# EasyEDA Pro project ProPrj_FOC Motor Driver _V02.epro, schematic v_resistor_2

## Sheets
1 gate drive: Board Name: V.Phase2_v01; Create Date: 2026-07-21; Page Name: gate drive; Project Name: FOC Motor Driver; Schematic Name: v_resistor_2; Update Date: 2026-07-22; Company: EasyEDA.com; Page Size: A4; Version: V1.0
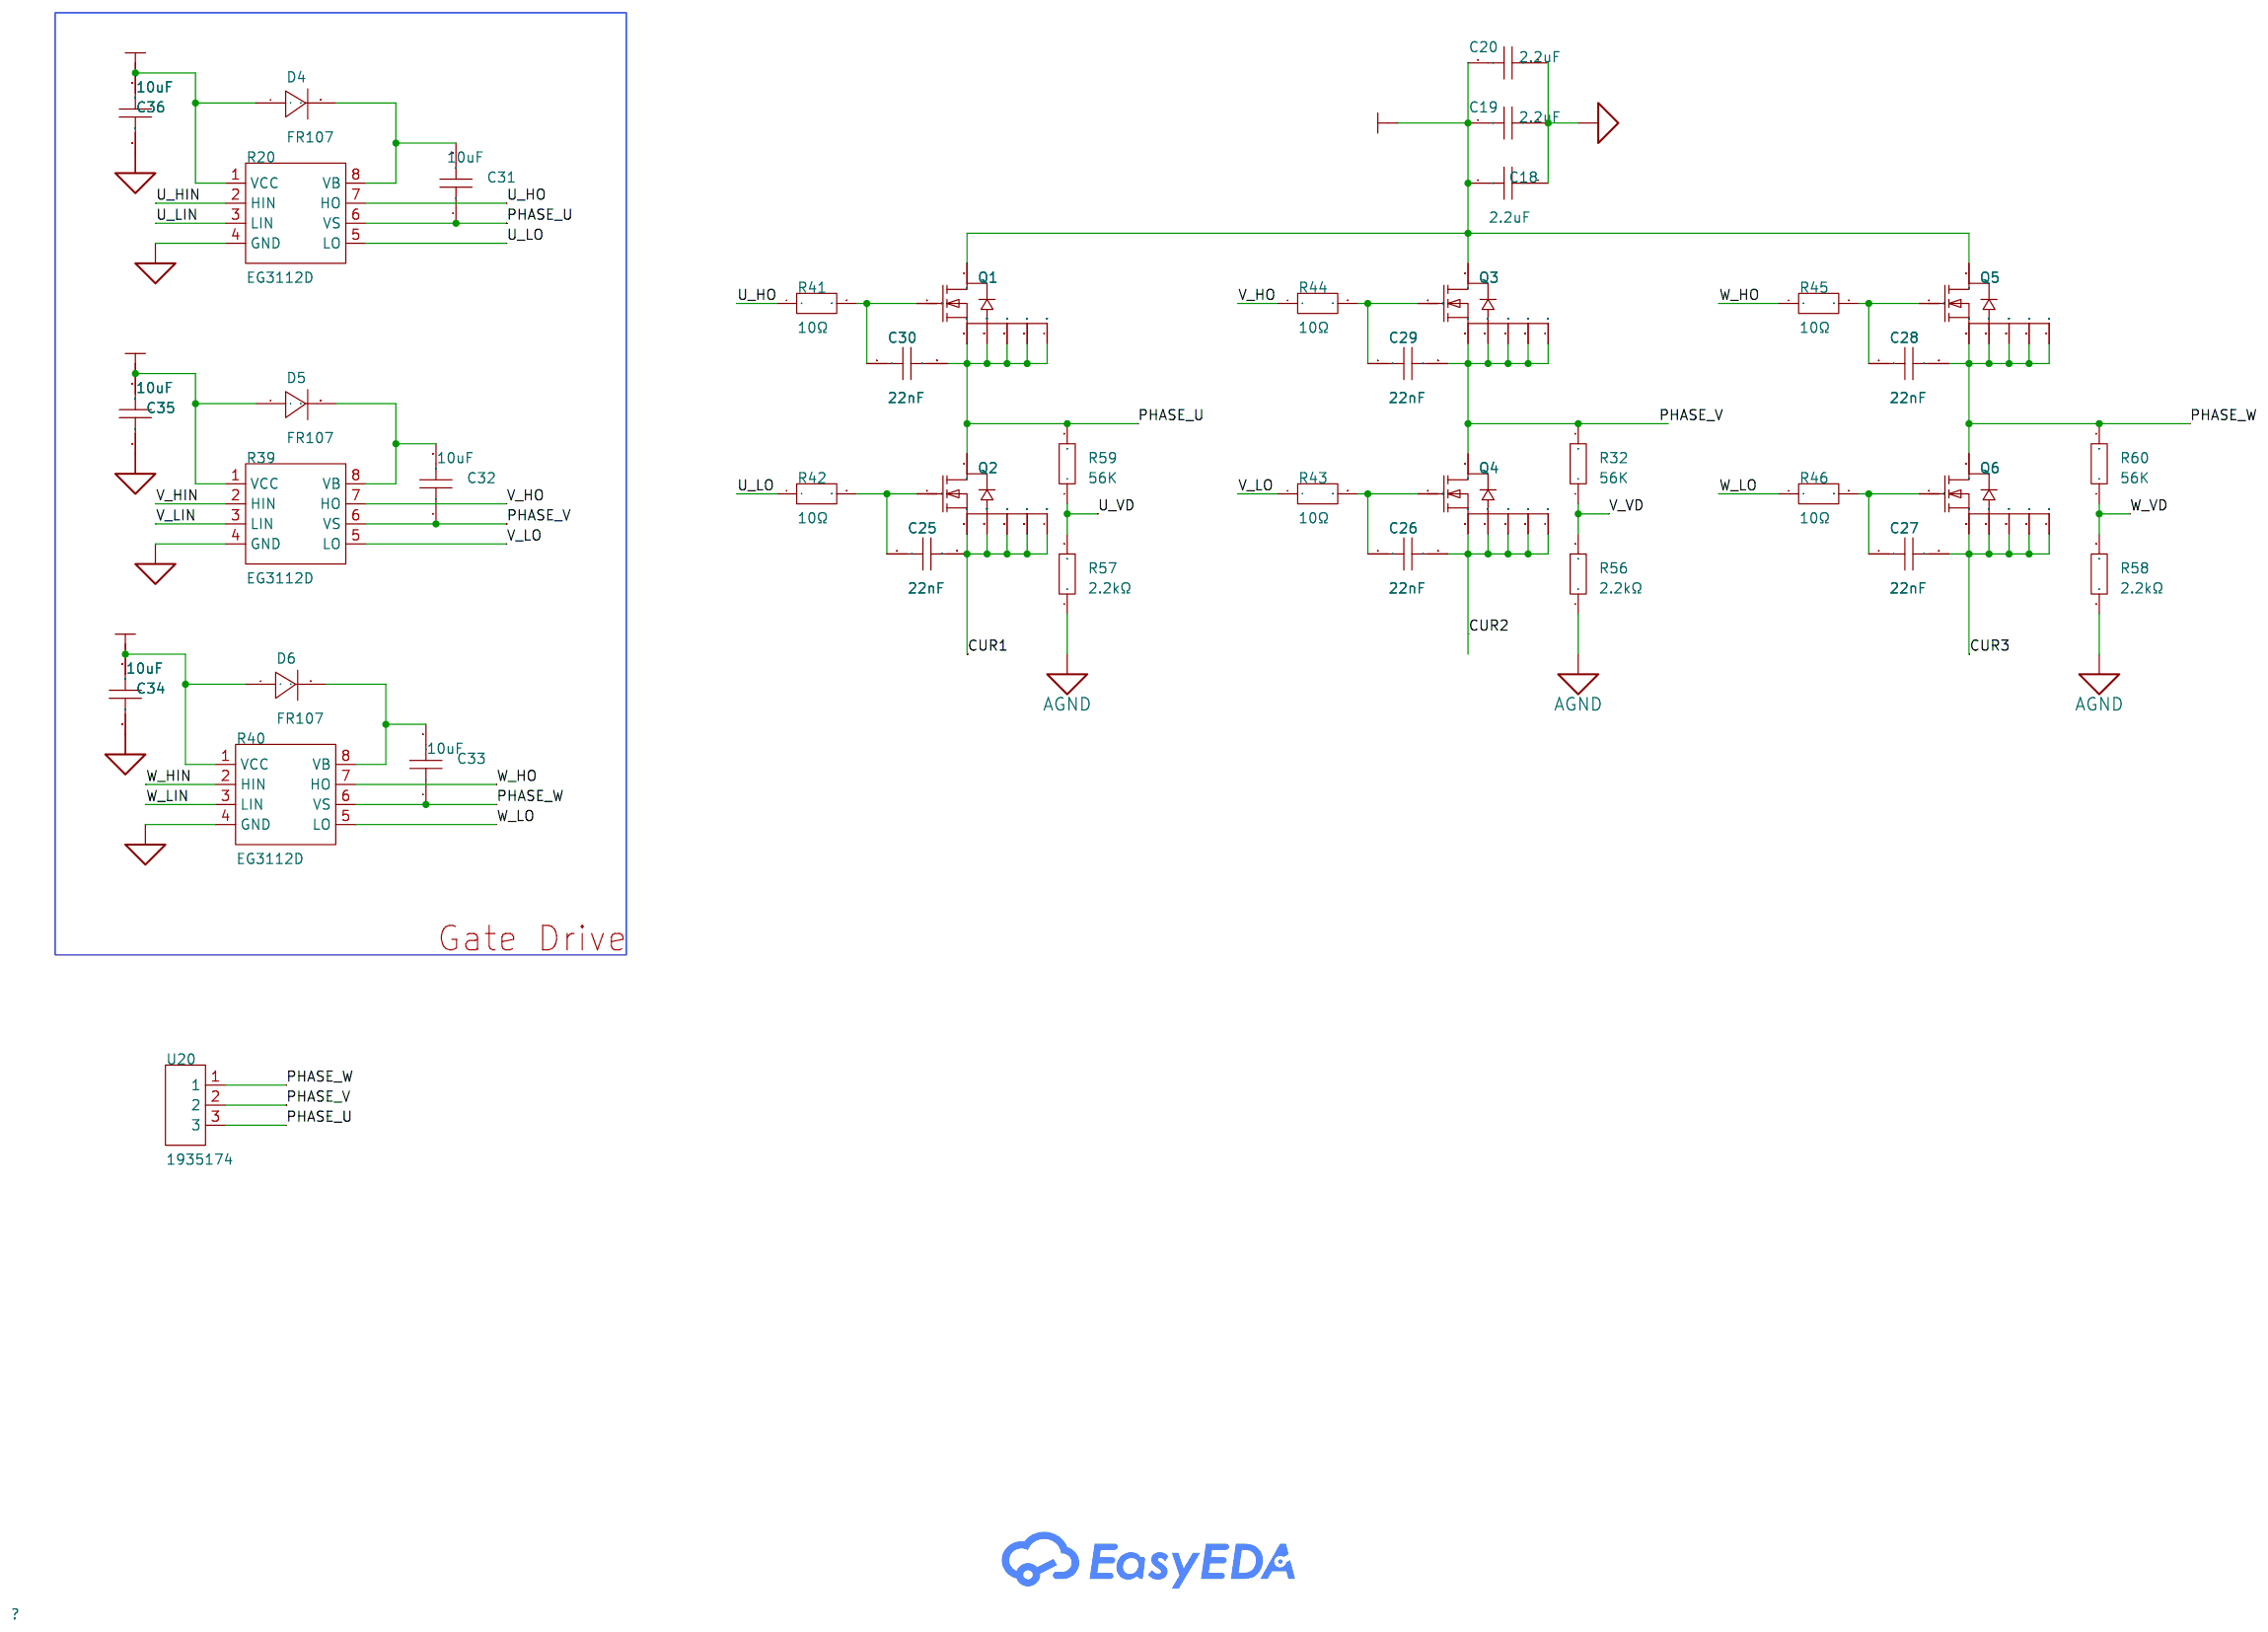
[diagram p1: gate drive]
2 MCU: Page Name: MCU; Update Date: 2026-07-30
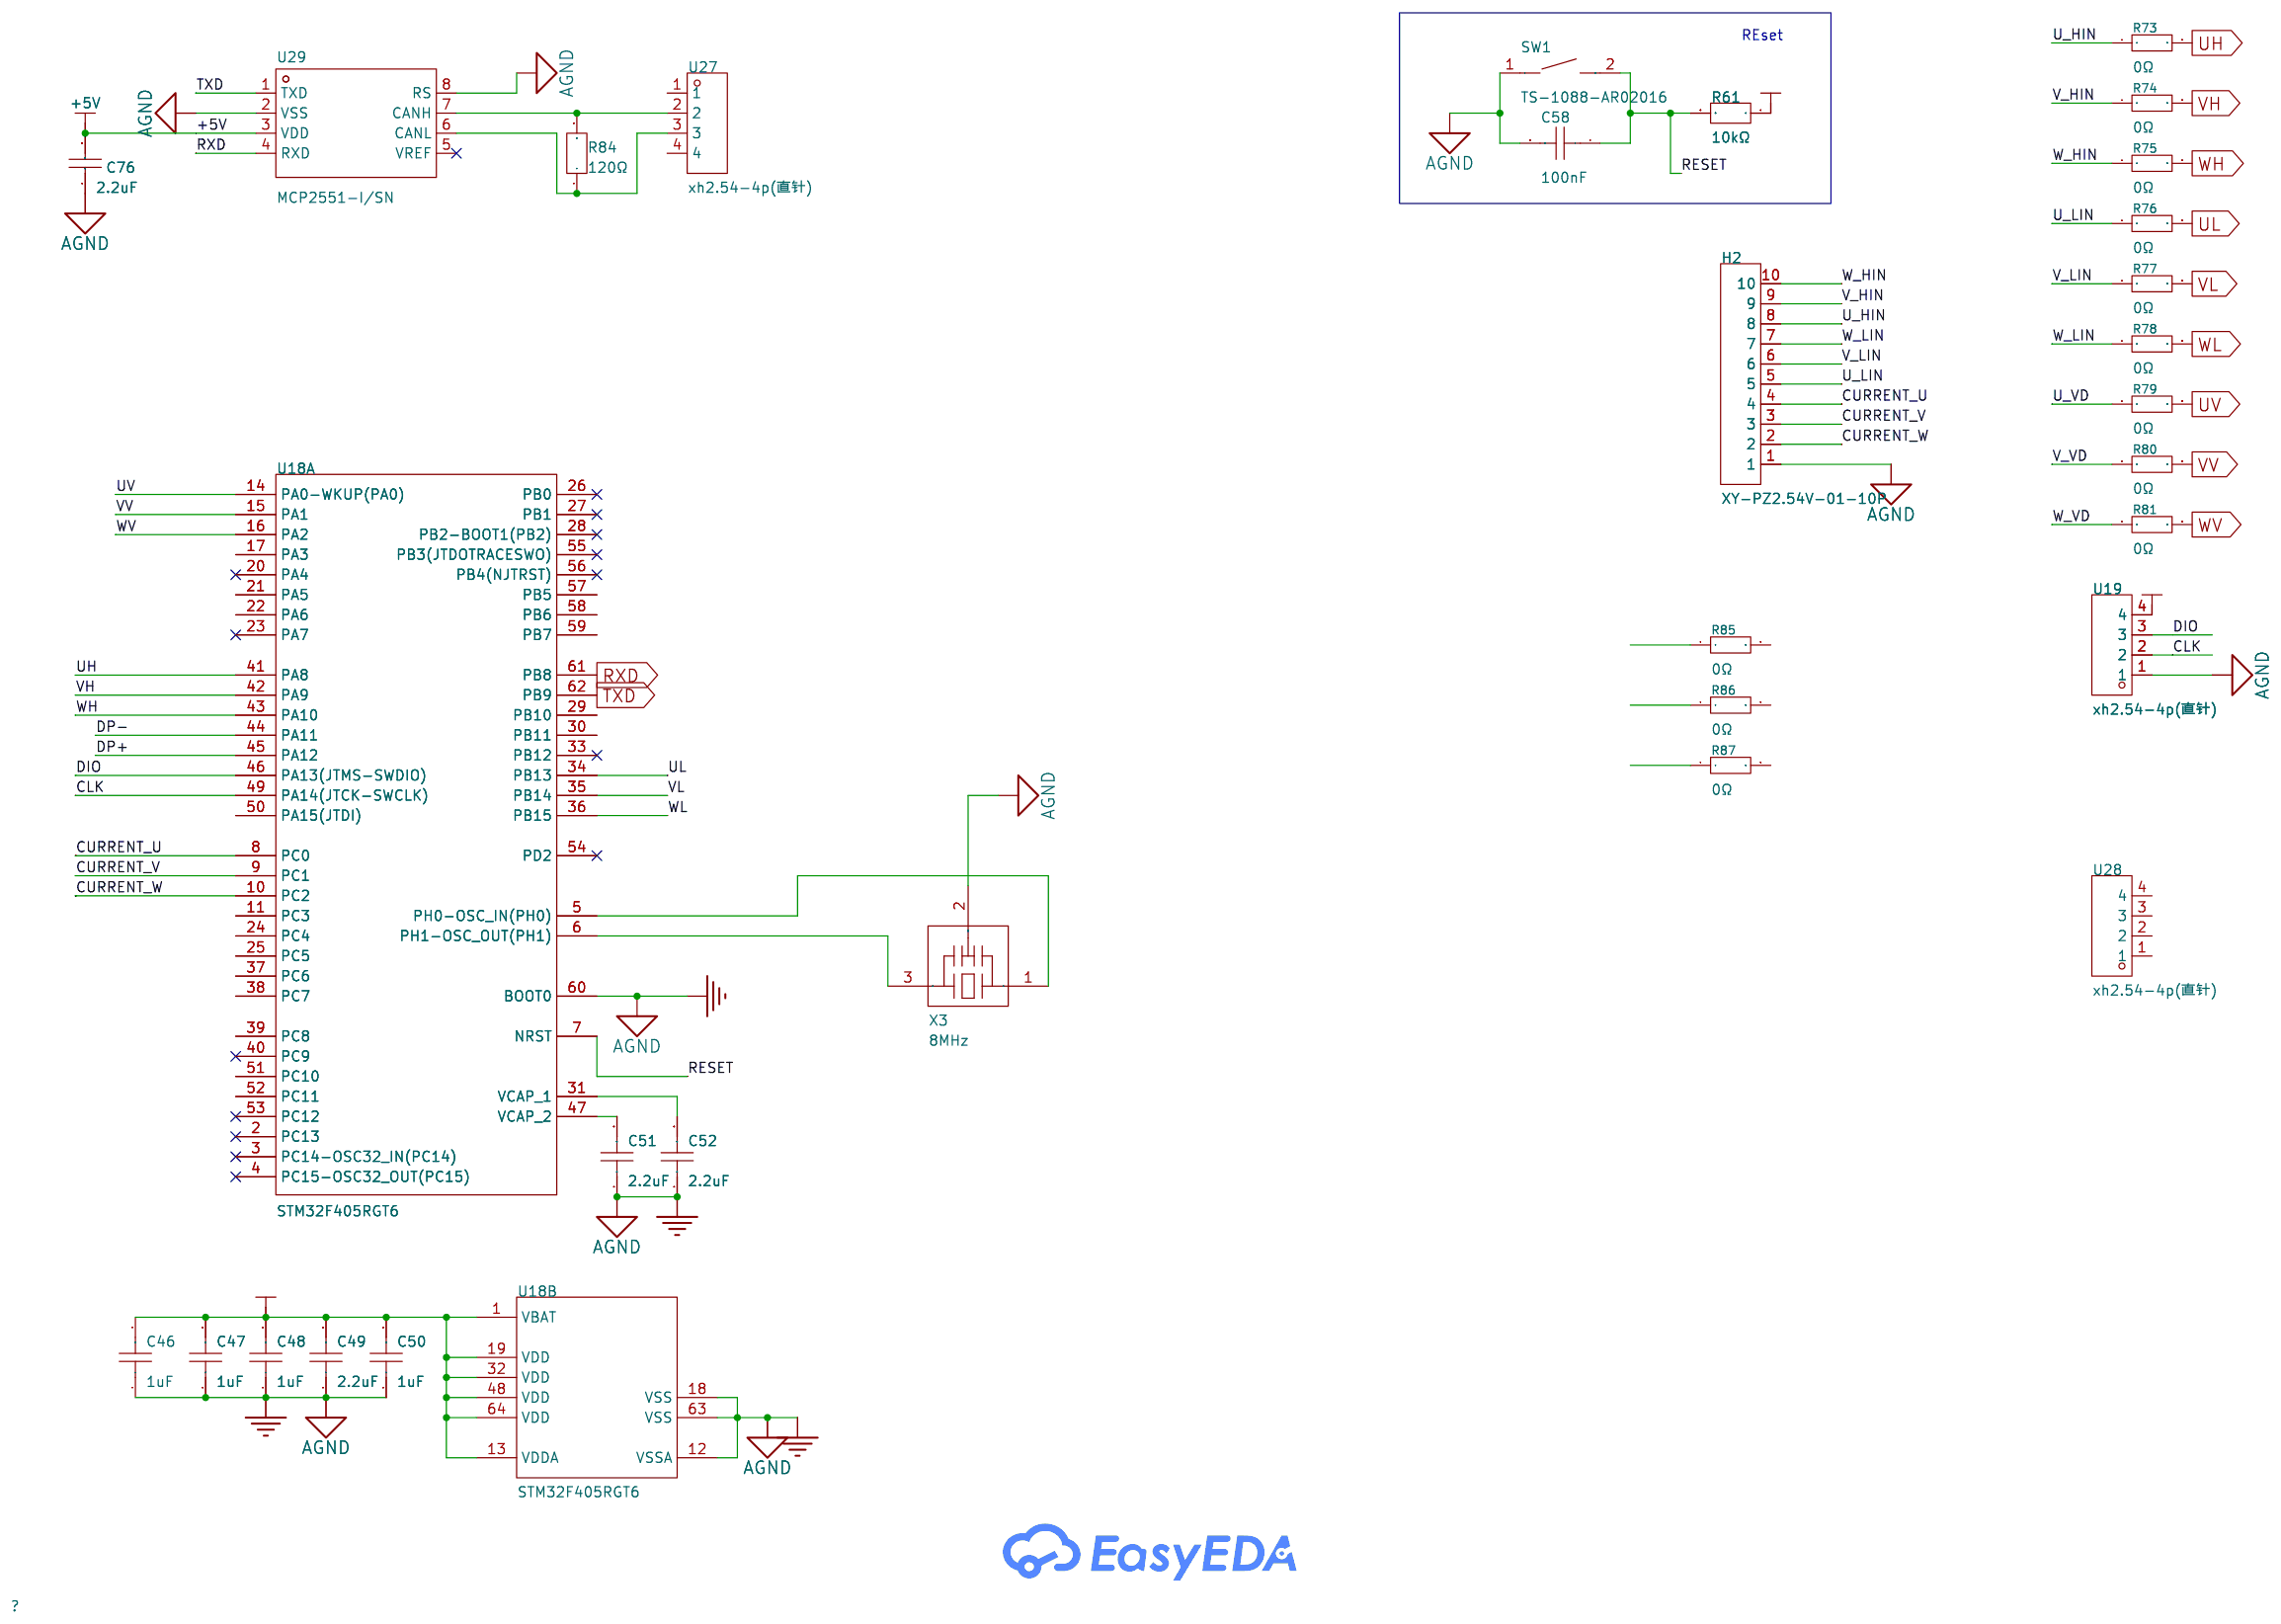
[diagram p2: MCU]
3 power Unit: Page Name: power Unit; Update Date: 2026-07-24
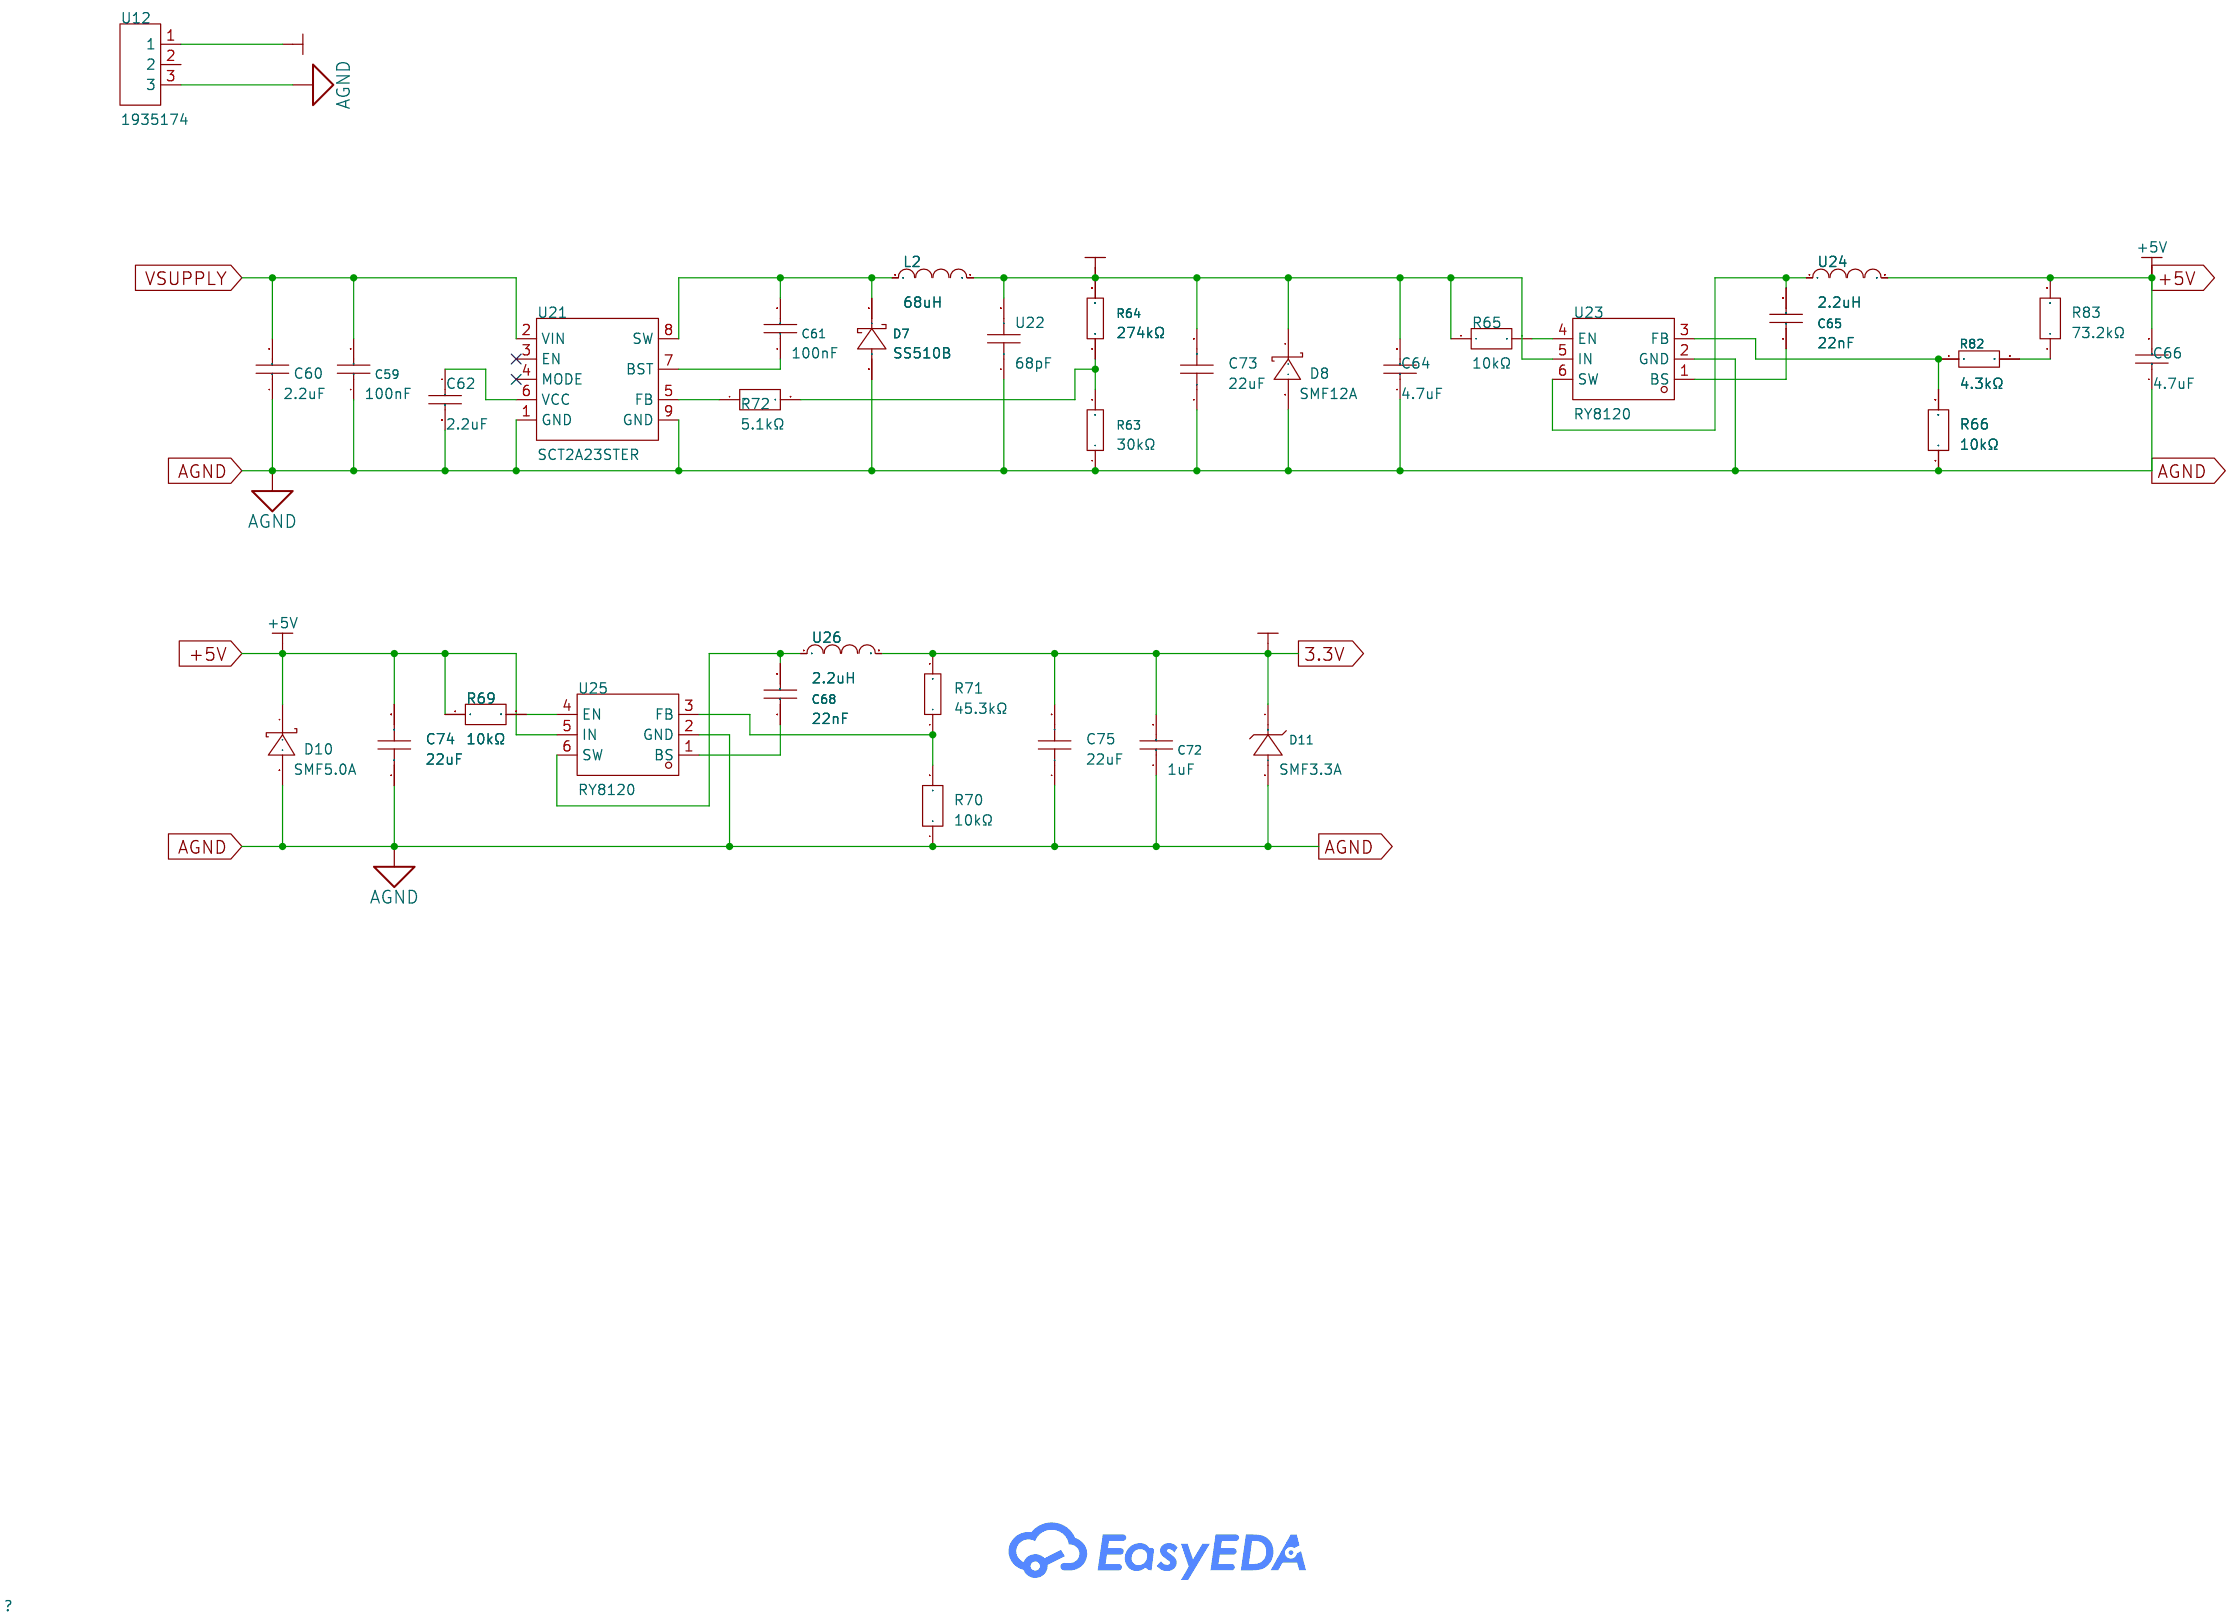
[diagram p3: power Unit]
4 CURRENT SENSE: Page Name: CURRENT SENSE; Update Date: 2026-07-21
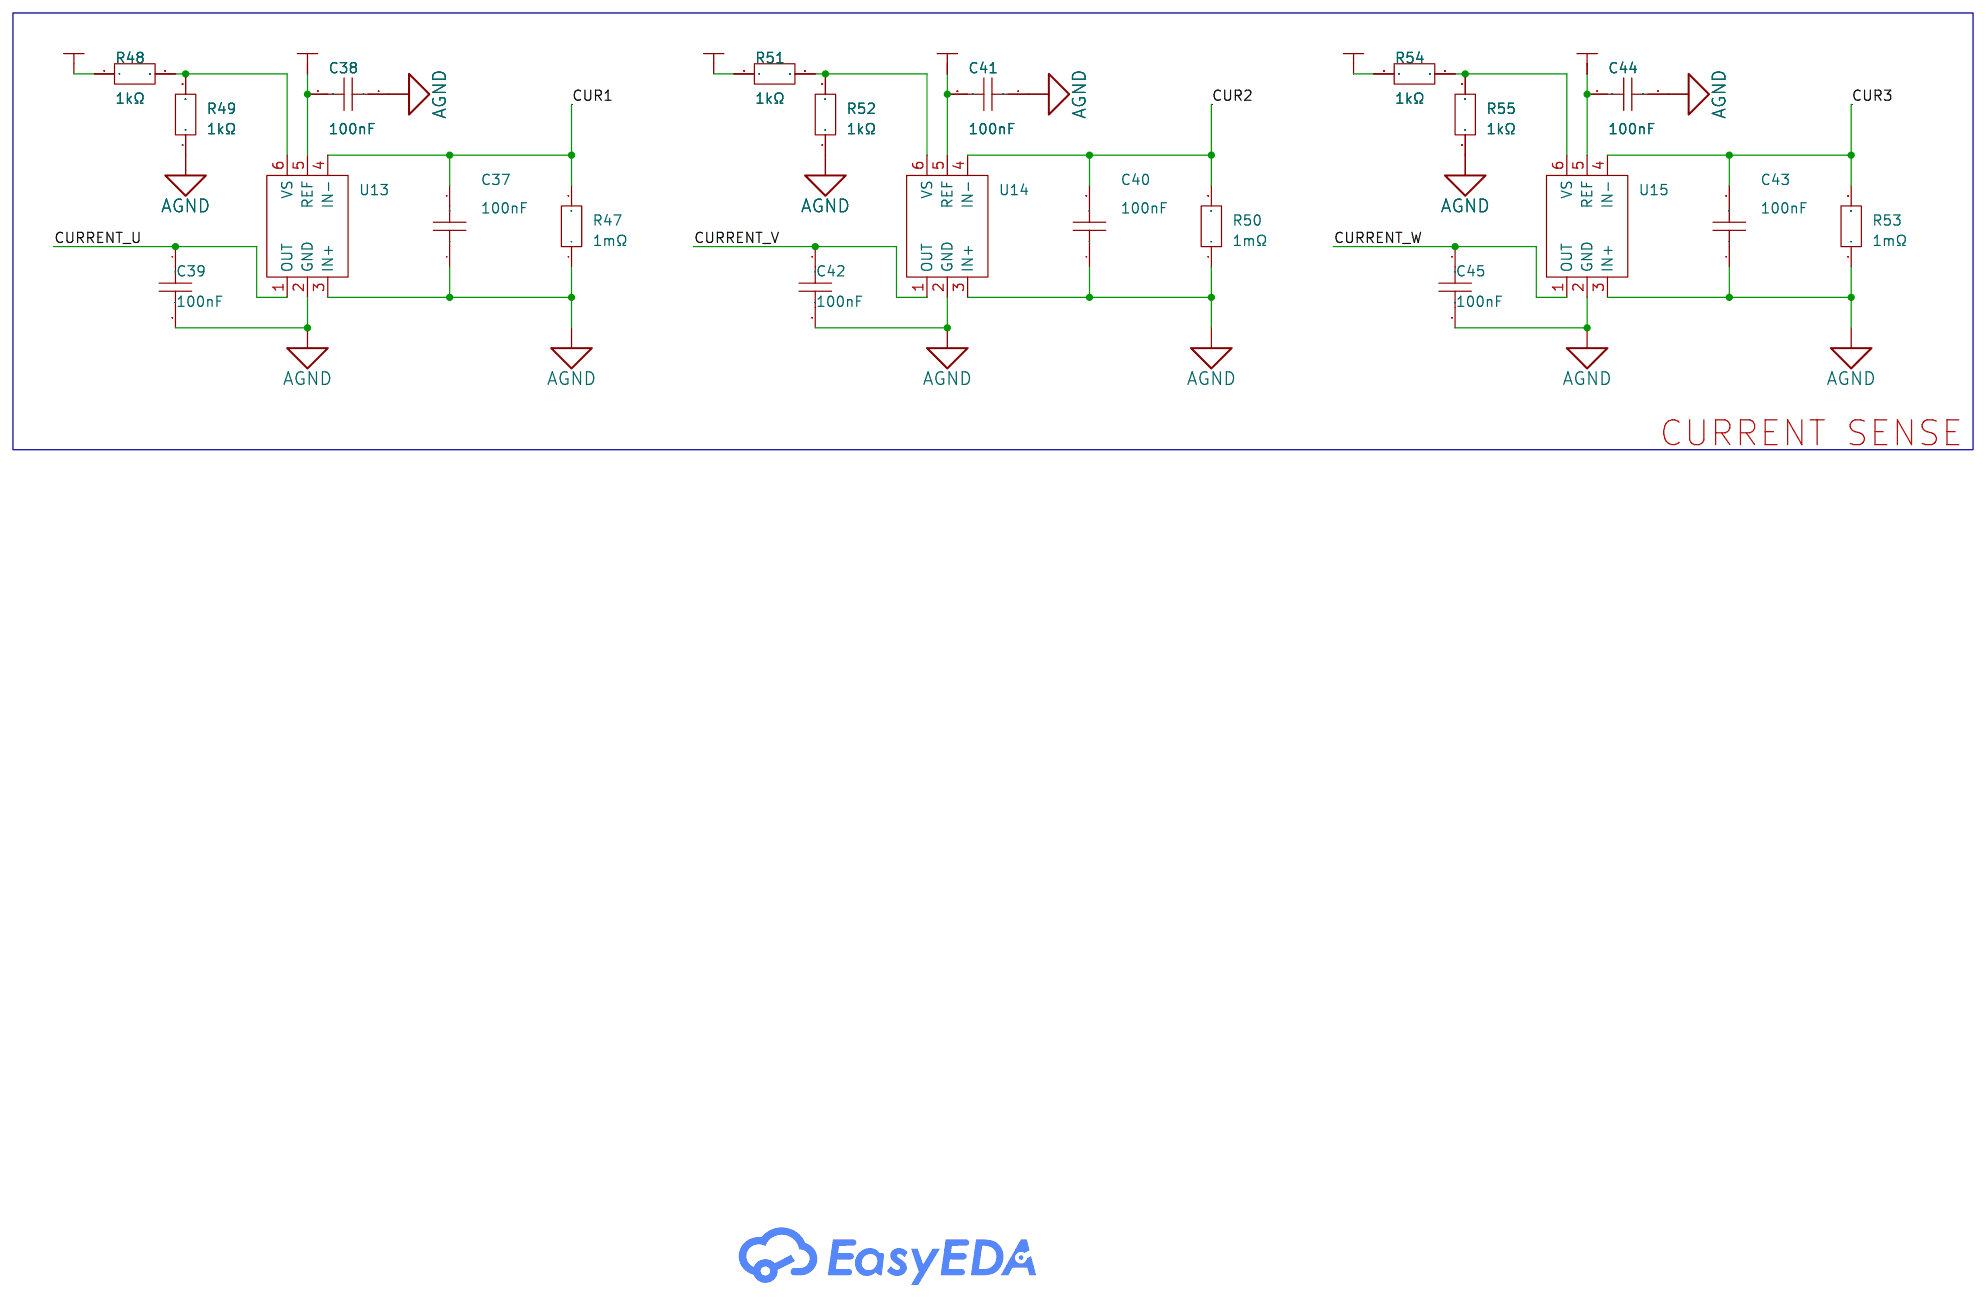
[diagram p4: CURRENT SENSE]

## Parts
sheet CURRENT SENSE
C37  100nF  [C0805]
C38  100nF  [C0805]
C39  100nF  [C0805]
C40  100nF  [C0805]
C41  100nF  [C0805]
C42  100nF  [C0805]
C43  100nF  [C0805]
C44  100nF  [C0805]
C45  100nF  [C0805]
R47  1mΩ  [R2512]
R48  1kΩ  [R0805]
R49  1kΩ  [R0805]
R50  1mΩ  [R2512]
R51  1kΩ  [R0805]
R52  1kΩ  [R0805]
R53  1mΩ  [R2512]
R54  1kΩ  [R0805]
R55  1kΩ  [R0805]
U13  INA181A1IDBVR  [SOT-23-6_L2.9-W1.6-P0.95-LS2.8-TL]
U14  INA181A1IDBVR  [SOT-23-6_L2.9-W1.6-P0.95-LS2.8-TL]
U15  INA181A1IDBVR  [SOT-23-6_L2.9-W1.6-P0.95-LS2.8-TL]
sheet gate drive
C18  2.2uF  [C0805]
C19  2.2uF  [C0805]
C20  2.2uF  [C0805]
C25  22nF  [C1206]
C26  22nF  [C1206]
C27  22nF  [C1206]
C28  22nF  [C1206]
C29  22nF  [C1206]
C30  22nF  [C1206]
C31  10uF  [C0805]
C32  10uF  [C0805]
C33  10uF  [C0805]
C34  10uF  [C0805]
C35  10uF  [C0805]
C36  10uF  [C0805]
D4  FR107  [SMA_L4.2-W2.7-LS5.3-FD]
D5  FR107  [SMA_L4.2-W2.7-LS5.3-FD]
D6  FR107  [SMA_L4.2-W2.7-LS5.3-FD]
Q1  IRFS7530TRL7PP  [D2PAK-7_L10.6-W9.6-P1.27-LS15.9-BR]
Q2  IRFS7530TRL7PP  [D2PAK-7_L10.6-W9.6-P1.27-LS15.9-BR]
Q3  IRFS7530TRL7PP  [D2PAK-7_L10.6-W9.6-P1.27-LS15.9-BR]
Q4  IRFS7530TRL7PP  [D2PAK-7_L10.6-W9.6-P1.27-LS15.9-BR]
Q5  IRFS7530TRL7PP  [D2PAK-7_L10.6-W9.6-P1.27-LS15.9-BR]
Q6  IRFS7530TRL7PP  [D2PAK-7_L10.6-W9.6-P1.27-LS15.9-BR]
R20  EG3112D  [SOP-8_L5.0-W3.9-P1.27-LS6.0-BL-1]
R32  56K  [R0805_NEW]
R39  EG3112D  [SOP-8_L5.0-W3.9-P1.27-LS6.0-BL-1]
R40  EG3112D  [SOP-8_L5.0-W3.9-P1.27-LS6.0-BL-1]
R41  10Ω  [R0603]
R42  10Ω  [R0603]
R43  10Ω  [R0603]
R44  10Ω  [R0603]
R45  10Ω  [R0603]
R46  10Ω  [R0603]
R56  2.2kΩ  [R0805]
R57  2.2kΩ  [R0805]
R58  2.2kΩ  [R0805]
R59  56K  [R0805_NEW]
R60  56K  [R0805_NEW]
U20  1935174  [CONN-TH_3P-P5.00_1935174]
sheet MCU
C46  1uF  [C0805]
C47  1uF  [C0805]
C48  1uF  [C0805]
C49  2.2uF  [C0805]
C50  1uF  [C0805]
C51  2.2uF  [C0805]
C52  2.2uF  [C0805]
C58  100nF  [C0805]
C76  2.2uF  [C1206]
H2  XY-PZ2.54V-01-10P  [HDR-TH_10P-P2.54-V-M_4]
R61  10kΩ  [R0805]
R73  0Ω  [R1206]
R74  0Ω  [R1206]
R75  0Ω  [R1206]
R76  0Ω  [R1206]
R77  0Ω  [R1206]
R78  0Ω  [R1206]
R79  0Ω  [R1206]
R80  0Ω  [R1206]
R81  0Ω  [R1206]
R84  120Ω  [R0805]
R85  0Ω  [R1206]
R86  0Ω  [R1206]
R87  0Ω  [R1206]
SW1  TS-1088-AR02016  [SW-SMD_L3.9-W3.0-P4.45]
U18  STM32F405RGT6  [LQFP-64_L10.0-W10.0-P0.50-LS12.0-BL]  (sections 1,2)
U19  xh2.54-4p(直针)  [CONN-TH_4P-P2.50-XH2.54-4P]
U27  xh2.54-4p(直针)  [CONN-TH_4P-P2.50-XH2.54-4P]
U28  xh2.54-4p(直针)  [CONN-TH_4P-P2.50-XH2.54-4P]
U29  MCP2551-I/SN  [SOIC-8_L4.9-W3.9-P1.27-LS6.0-BL]
X3  8MHz  [OSC-SMD_3P-L3.2-W1.3-P1.2-L]
sheet power Unit
C59  100nF  [C1206]
C60  2.2uF  [C1206]
C61  100nF  [C1206]
C62  2.2uF  [C1206]
C64  4.7uF  [C0805]
C65  22nF  [C0805]
C66  4.7uF  [C0805]
C68  22nF  [C0805]
C72  1uF  [C0805]
C73  22uF  [C0805]
C74  22uF  [C0805]
C75  22uF  [C0805]
D7  SS510B  [SMB_L4.3-W3.6-LS5.3-RD]
D8  SMF12A  [SOD-123_L2.8-W1.8-LS3.7-RD]
D10  SMF5.0A  [SOD-123_L2.8-W1.8-LS3.7-RD]
D11  SMF3.3A  [SOD-123_L2.8-W1.8-LS3.7-RD]
L2  68uH  [IND-SMD_L7.8-W7.0_SCD0705N]
R63  30kΩ  [R0603]
R64  274kΩ  [R0805]
R65  10kΩ  [R0603]
R66  10kΩ  [R0603]
R69  10kΩ  [R0603]
R70  10kΩ  [R0603]
R71  45.3kΩ  [R0603]
R72  5.1kΩ  [R1206]
R82  4.3kΩ  [R0603]
R83  73.2kΩ  [R0603]
U12  1935174  [CONN-TH_3P-P5.00_1935174]
U21  SCT2A23STER  [ESOP-8_L4.9-W3.9-P1.27-LS6.0-BL-EP-1]
U22  68pF  [C0805]
U23  RY8120  [SOT-23-6_L2.9-W1.6-P0.95-LS2.8-BL]
U24  2.2uH  [IND-SMD_L2.5-W2.0-VLS252012CX-150M]
U25  RY8120  [SOT-23-6_L2.9-W1.6-P0.95-LS2.8-BL]
U26  2.2uH  [IND-SMD_L2.5-W2.0-VLS252012CX-150M]

## Library data of the parts
C37-C45 C58 = C0805X104K5RAC3123: Capacitance:100nF Tolerance:±10% Tolerance:±10% Voltage Rating:50V Temperature Coefficient:X7R; LCSC Part Name: 100nF ±10% 50V; Supplier Part: C141171; Manufacturer: KEMET(基美); Supplier Footprint: 0805; JLCPCB Part Class: Extended Part; Datasheet: https://item.szlcsc.com/datasheet/C0805X104K5RAC3123/152501.html; Supplier: LCSC; Tolerance: ±10%; Voltage Rating: 50V; Temperature Coefficient: X7R
R47 R50 R53 = HIXD25LR001F: Type:Alloy Resistor Resistance:1mΩ Tolerance:±1% Tolerance:±1% Power(Watts):2W Temperature Coefficient:±350ppm/℃ Temperature Coefficient:±350ppm/℃ Mounting Type:SMD; LCSC Part Name: 1mΩ ±1% 2W; Supplier Part: C52015882; Manufacturer: RVR(鹏科); Supplier Footprint: 2512; JLCPCB Part Class: Extended Part; Datasheet: https://item.szlcsc.com/datasheet/HIXD25LR001F/54758989.html; Supplier: LCSC; Type: Alloy Resistor; Tolerance: ±1%; Power(Watts): 2W; Temperature Coefficient: ±350ppm/℃; Mounting Type: SMD
R48 R49 R51 R52 R54 R55 R61 = AS05W3J0102T5E: Type:Thick Film Resistors Resistance:1kΩ Tolerance:±5% Tolerance:±5% Power(Watts): Overload Voltage (Max): Operating Temperature Range:-55℃~+155℃ Operating Temperature Range:-55℃~+155℃; LCSC Part Name: 1kΩ ±5% 333.333mW 厚膜电阻; Supplier Part: C966151; Manufacturer: UNI-ROYAL(厚声); Supplier Footprint: 0805; JLCPCB Part Class: Extended Part; Datasheet: https://atta.szlcsc.com/upload/public/pdf/source/20200723/C560412_34ABBCC623B52ADD707B94178459E29E.pdf; Supplier: LCSC; Type: Thick Film Resistors; Tolerance: ±5%; Operating Temperature Range: -55℃~+155℃
U13-U15 = INA181A1IDBVR: Number of Channels:1 Vcm - Common Mode Voltage:-200mV~26V Vcm - Common Mode Voltage:-200mV~26V Gain:20V/V Bandwidth:350kHz Ib - Input Bias Current:6uA Vos - Input Offset Voltage:25uV Operating Temperature:-40℃~+125℃ Operating Temperature:-40℃~+125℃ Differ; LCSC Part Name: 双向低侧和高侧电压输出电流感应放大器; Supplier Part: C2058943; Manufacturer: TI(德州仪器); Supplier Footprint: SOT-23-6; JLCPCB Part Class: Extended Part; Datasheet: https://www.ti.com/cn/lit/ds/symlink/ina4181.pdf; Supplier: LCSC; Number of Channels: 1; Vcm - Common Mode Voltage: -200mV~26V; Gain: 20V/V; Bandwidth: 350kHz; Ib - Input Bias Current: 6uA; Vos - Input Offset Voltage: 25uV; Operating Temperature: -40℃~+125℃; Differential Voltage: ±26V; Single Supply: 2.7V~5.5V; Quiescent Current: 195uA; Output Current: 8mA; Input Offset Voltage Drift(Vos TC): 1uV/℃; Input Offset Current(Ios): 0.05uA; Slew Rate: 2V/us; Common Mode Rejection Ratio (CMRR): 100dB; Noise density(eN): 40nV/√Hz@1kHz; Features: Analog output interface；Bidirectional detection；High-side detection；Low-side detection；Programmable output reference level
C18-C20 = CL21A225KBQNNNE: Capacitance:2.2uF Tolerance:±10% Tolerance:±10% Voltage Rating:50V Temperature Coefficient:X5R; LCSC Part Name: 2.2uF ±10% 50V; Supplier Part: C377773; Manufacturer: SAMSUNG(三星); Supplier Footprint: 0805; Datasheet: https://item.szlcsc.com/datasheet/CL21A225KBQNNNE/350246.html; Supplier: LCSC; Tolerance: ±10%; Voltage Rating: 50V; Temperature Coefficient: X5R
C25-C30 = HHV1206R7223K631NSPJ: Capacitance:22nF Tolerance:±10% Tolerance:±10% Voltage Rating:630V Temperature Coefficient:X7R; LCSC Part Name: 22nF ±10% 630V; Supplier Part: C5186842; Manufacturer: Chinocera(华瓷); Supplier Footprint: 1206; JLCPCB Part Class: Extended Part; Datasheet: https://item.szlcsc.com/datasheet/HHV1206R7223K631NSPJ/5857851.html; Supplier: LCSC; Tolerance: ±10%; Voltage Rating: 630V; Temperature Coefficient: X7R
C31-C36 = GRM21BR61H106KE43L: Capacitance:10uF Tolerance:±10% Tolerance:±10% Voltage Rating:50V Temperature Coefficient:X5R; LCSC Part Name: 10uF ±10% 50V; Supplier Part: C440198; Manufacturer: muRata(村田); Supplier Footprint: 0805; JLCPCB Part Class: Basic Part; Datasheet: https://item.szlcsc.com/datasheet/GRM21BR61H106KE43L/439567.html; Supplier: LCSC; Tolerance: ±10%; Voltage Rating: 50V; Temperature Coefficient: X5R
D4-D6 = FR107: Diode Configuration:Independent Type Forward Voltage (Vf@If):1.3V@1A Reverse Voltage (Vr): Rectified Current:1A Reverse Leakage Current:5mA@1kV Reverse Recovery Time (trr): Operating Temperature:-65℃~+150℃@(Tj) Operating Temperature:-65℃~+150℃@(Tj); LCSC Part Name: 电压:1kV 电流:1A 打扁工艺; Supplier Part: C2934869; Manufacturer: YONGYUTAI(永裕泰); Supplier Footprint: SMA; Datasheet: https://atta.szlcsc.com/upload/public/pdf/source/20211220/09EF9D5C307779228ED577DD161FCE60.pdf; Supplier: LCSC; Diode Configuration: Independent Type; Forward Voltage (Vf@If): 1.3V@1A; Rectified Current: 1A; Reverse Leakage Current: 5mA@1kV; Operating Temperature: -65℃~+150℃@(Tj)
Q1-Q6 = IRFS7530TRL7PP: Number:1 N-Channel Drain to Source Voltage:60V Current - Continuous Drain(Id):338A RDS(on):1.4mΩ@10V,100A Pd - Power Dissipation:375W Gate Threshold Voltage (Vgs(th)):3.7V Gate Charge(Qg):354nC@10V Input Capacitance(Ciss):12.96nF Reverse Transfer Capacita; LCSC Part Name: 1个N沟道 耐压:60V 电流:338A; Supplier Part: C445669; Manufacturer: Infineon(英飞凌); Supplier Footprint: TO-263-7; JLCPCB Part Class: Extended Part; Datasheet: https://item.szlcsc.com/datasheet/IRFS7530TRL7PP/447258.html; Supplier: LCSC; Number: 1 N-Channel; Drain to Source Voltage: 60V; Current - Continuous Drain(Id): 338A; RDS(on): 1.4mΩ@10V,100A; Pd - Power Dissipation: 375W; Gate Threshold Voltage (Vgs(th)): 3.7V; Gate Charge(Qg): 354nC@10V; Input Capacitance(Ciss): 12.96nF; Reverse Transfer Capacitance (Crss@Vds): 760pF; Operating Temperature: -55℃~+175℃
R20 R39 R40 = EG3112D: Driven Configuration:Low Side；High Side Load Type:MOSFET；IGBT Number of Drivers:2 Current - Output Low(IOL):2.5A Current - Output High(IOH):2A Voltage - Supply:4V~20V Voltage - Supply:4V~20V Rise Time:120ns Fall Time:80ns Propagation Delay tpLH:- Propagat; LCSC Part Name: 大功率MOS管、IGBT管栅极驱动芯片; Supplier Part: C2929096; Manufacturer: EG(屹晶微); Supplier Footprint: SOP-8; JLCPCB Part Class: Extended Part; Datasheet: https://item.szlcsc.com/datasheet/EG3112D/3261573.html; Supplier: LCSC; Driven Configuration: Low Side；High Side; Load Type: MOSFET；IGBT; Number of Drivers: 2; Current - Output Low(IOL): 2.5A; Current - Output High(IOH): 2A; Voltage - Supply: 4V~20V; Rise Time: 120ns; Fall Time: 80ns; Operating Temperature: -45℃~+125℃; Input Logic Level - Low: -300mV~1V; Quiescent Current(Iq): 50uA
R32 R59 R60 = RK73H1JTTD10R0F: Type:Thick Film Resistors Resistance: Tolerance:±1% Tolerance:±1% Power(Watts): Overload Voltage (Max): Temperature Coefficient:±100ppm/℃ Temperature Coefficient:±100ppm/℃ Operating Temperature Range:-55℃~+155℃ Operating Temperature Range:-55℃~+155℃; LCSC Part Name: 厚膜电阻 10Ω ±1% 125mW; Supplier Part: C173372; Manufacturer: KOA; Supplier Footprint: 0603; JLCPCB Part Class: Extended Part; Datasheet: https://atta.szlcsc.com/upload/public/pdf/source/20180910/C284139_D19228803A916EF20734AAE00A9B1EE6.pdf; Supplier: LCSC; Type: Thick Film Resistors; Tolerance: ±1%; Temperature Coefficient: ±100ppm/℃; Operating Temperature Range: -55℃~+155℃
R41-R46 = WF06P10R0FTL: Resistance:10Ω Tolerance:±1% Tolerance:±1% Power(Watts):125mW Voltage-Supply(Max):50V Temperature Coefficient:±100ppm/℃ Temperature Coefficient:±100ppm/℃ Operating Temperature:-55℃~+155℃ Operating Temperature:-55℃~+155℃; LCSC Part Name: 10Ω ±1% 125mW; Supplier Part: C2885454; Manufacturer: Walsin(华新科); Supplier Footprint: 0603; JLCPCB Part Class: Extended Part; Datasheet: https://item.szlcsc.com/datasheet/WF06P10R0FTL/3096111.html; Supplier: LCSC; Tolerance: ±1%; Power(Watts): 125mW; Voltage-Supply(Max): 50V; Temperature Coefficient: ±100ppm/℃; Operating Temperature: -55℃~+155℃
R56-R58 = RK73B2ATTD222J: Type:Thick Film Resistors Resistance: Tolerance:±5% Tolerance:±5% Power(Watts): Overload Voltage (Max): Temperature Coefficient:±200ppm/℃ Temperature Coefficient:±200ppm/℃ Operating Temperature Range:-55℃~+155℃ Operating Temperature Range:-55℃~+155℃; LCSC Part Name: 厚膜电阻 2.2kΩ ±5% 250mW; Supplier Part: C159914; Manufacturer: KOA; Supplier Footprint: 0805; Datasheet: https://atta.szlcsc.com/upload/public/pdf/source/20190412/C306845_C691C67B9FF4609DA2A4DC602C4F98FE.pdf; Supplier: LCSC; Type: Thick Film Resistors; Tolerance: ±5%; Temperature Coefficient: ±200ppm/℃; Operating Temperature Range: -55℃~+155℃
U12 U20 = 1935174: Number of Positions or Pins:1x3P Pitch:5mm Color:Green Mounting Type:Through Hole Number of Pins:3P Number of Rows:1 Number of PINs Per Row:3 Current Rating:18A Voltage Rating (Max):300V Wire Gauge - AWG:12~26 Operating Temperature:- Operating Temperature; LCSC Part Name: 1x3P 5mm 直插 排数:1 每排P数:3; Supplier Part: C3816891; Manufacturer: Phoenix Contact(菲尼克斯); Supplier Footprint: 插件,P=5mm; JLCPCB Part Class: Extended Part; Datasheet: https://item.szlcsc.com/datasheet/1935174/4384565.html; Supplier: LCSC; Number of Positions or Pins: 1x3P; Pitch: 5mm; Color: Green; Mounting Type: Through Hole; Number of Pins: 3P; Number of Rows: 1; Number of PINs Per Row: 3; Current Rating: 18A; Voltage Rating (Max): 300V; Wire Gauge - AWG: 12~26
C46-C52 = FS21X105K160ECG: Capacitance:1uF Tolerance:±10% Tolerance:±10% Voltage Rating:16V Temperature Coefficient:X7R; LCSC Part Name: 1uF ±10% 16V; Supplier Part: C525343; Manufacturer: PSA(信昌电陶); Supplier Footprint: 0805; JLCPCB Part Class: Extended Part; Datasheet: https://item.szlcsc.com/datasheet/FS21X105K160ECG/543470.html; Supplier: LCSC; Tolerance: ±10%; Voltage Rating: 16V; Temperature Coefficient: X7R
C60 C62 C76 = CL31B225KBHNNNE: Capacitance:2.2uF Tolerance:±10% Tolerance:±10% Voltage Rating:50V Temperature Coefficient:X7R; LCSC Part Name: 2.2uF ±10% 50V; Supplier Part: C50254; Manufacturer: SAMSUNG(三星); Supplier Footprint: 1206; Datasheet: https://item.szlcsc.com/datasheet/CL31B225KBHNNNE/51263.html; Supplier: LCSC; Tolerance: ±10%; Voltage Rating: 50V; Temperature Coefficient: X7R
H2 = XY-PZ2.54V-01-10P: LCSC Part Name: 1x10P 间距:2.54mm 方针 直插; Supplier Part: C53244518; Manufacturer: XYECONN(辛译); Supplier Footprint: 插件,P=2.54mm; JLCPCB Part Class: Extended Part; Datasheet: https://item.szlcsc.com/datasheet/XY-PZ2.54V-01-10P/56301404.html; Supplier: LCSC
R73-R81 R85-R87 = 1206W4F0000T5E: Type:Thick Film Resistor Resistance:0Ω Tolerance:±1% Tolerance:±1% Power(Watts):250mW Voltage-Supply(Max):200V Temperature Coefficient:±800ppm/℃ Temperature Coefficient:±800ppm/℃ Operating Temperature:-55℃~+155℃ Operating Temperature:-55℃~+155℃; LCSC Part Name: 0Ω ±1% 250mW 厚膜电阻; Supplier Part: C17888; Manufacturer: UNI-ROYAL(厚声); Supplier Footprint: 1206; Datasheet: https://item.szlcsc.com/datasheet/1206W4F0000T5E/18576.html; Supplier: LCSC; Type: Thick Film Resistor; Tolerance: ±1%; Power(Watts): 250mW; Voltage-Supply(Max): 200V; Temperature Coefficient: ±800ppm/℃; Operating Temperature: -55℃~+155℃
R84 = CRGCQ0805F120R: Type:Thick Film Resistor Resistance:120Ω Tolerance:±1% Tolerance:±1% Power(Watts):125mW Temperature Coefficient:±100ppm/℃ Temperature Coefficient:±100ppm/℃ Operating Temperature:-55℃~+155℃ Operating Temperature:-55℃~+155℃; LCSC Part Name: 厚膜电阻 120Ω ±1% 125mW; Supplier Part: C5162608; Manufacturer: TE Connectivity(泰科电子); Supplier Footprint: 0805; JLCPCB Part Class: Extended Part; Datasheet: https://item.szlcsc.com/datasheet/CRGCQ0805F120R/5811582.html; Supplier: LCSC; Type: Thick Film Resistor; Tolerance: ±1%; Power(Watts): 125mW; Temperature Coefficient: ±100ppm/℃; Operating Temperature: -55℃~+155℃
SW1 = TS-1088-AR02016: Circuit:SPST Actuator Style:Round Button Operating Force:1.6N Mounting Type:Surface Mount,Vertical Length:3.9mm Width:3mm Switch Height:2mm with Bracket:Without Bracket Contact Current:50mA Voltage Rating:12V Actuator/Cap Color:Black With Lamp:- IP Rating; LCSC Part Name: 3.9*3*2mm 立贴 轻触开关; Supplier Part: C720477; Manufacturer: XUNPU(讯普); Supplier Footprint: SMD,4x3mm; JLCPCB Part Class: Basic Part; Datasheet: https://item.szlcsc.com/datasheet/TS-1088-AR02016/763484.html; Supplier: LCSC; Circuit: SPST; Actuator Style: Round Button; Operating Force: 1.6N; Mounting Type: Surface Mount,Vertical; Length: 3.9mm; Width: 3mm; Switch Height: 2mm; with Bracket: Without Bracket; Contact Current: 50mA; Voltage Rating: 12V; Actuator/Cap Color: Black; Termination Style: SMD(SMT) Tab; Life: 100,000 cycles; Operating Temperature: -30℃~+80℃
U18 = STM32F405RGT6: CPU Core:ARM Cortex-M4 CPU Maximum Speed:168MHz Core Size:32 Bit Program Storage Size:1MB Program Memory Type:FLASH RAM Size:192KB EEPROM:- Number of I/O:51 ADC (Bit):12bit DAC (Bit):12bit Oscillator Type:Built-in Voltage - Supply:1.8V~3.6V Voltage - Supp; LCSC Part Name: 带DSP和FPU的高性能基础系列ARM Cortex-M4 MCU，具有1 MB Flash、168 MHz CPU和ART加速器; Supplier Part: C15742; Manufacturer: ST(意法半导体); Supplier Footprint: LQFP-64(10x10); JLCPCB Part Class: Extended Part; Datasheet: https://item.szlcsc.com/datasheet/STM32F405RGT6/16424.html; Supplier: LCSC; CPU Core: ARM Cortex-M4; CPU Maximum Speed: 168MHz; Core Size: 32 Bit; Program Storage Size: 1MB; Program Memory Type: FLASH; RAM Size: 192KB; Number of I/O: 51; ADC (Bit): 12bit; DAC (Bit): 12bit; Oscillator Type: Built-in; Voltage - Supply: 1.8V~3.6V; Operating Temperature: -40℃~+85℃
U19 U27 U28 = xh2.54-4p(直针): Supplier Part: C9900015350; JLCPCB Part Class: Extended Part; Supplier: LCSC
U29 = MCP2551-I/SN: Type:CAN Transceiver Data Rate:1Mbps Voltage - Supply:5V Voltage - Supply:5V Current - Supply:75mA Operating Temperature:-40℃~+85℃ Operating Temperature:-40℃~+85℃ Number of Channels:- Quiescent Supply Current:365uA; LCSC Part Name: 高速CAN收发器; Supplier Part: C7376; Manufacturer: MICROCHIP(美国微芯); Supplier Footprint: SOIC-8; JLCPCB Part Class: Extended Part; Datasheet: https://item.szlcsc.com/datasheet/MCP2551-I%252FSN/7853.html; Supplier: LCSC; Type: CAN Transceiver; Data Rate: 1Mbps; Voltage - Supply: 5V; Current - Supply: 75mA; Operating Temperature: -40℃~+85℃; Quiescent Supply Current: 365uA
X3 = CSTCE8M00G55-R0: Frequency:8MHz Built - in Load Capacitance:33pF Resonant Impedance:- Operating Temperature:-20℃~+80℃ Operating Temperature:-20℃~+80℃; LCSC Part Name: 停产 8M ±0.5% 33pF; Supplier Part: C70457; Manufacturer: muRata(村田); Supplier Footprint: SMD3213-3P; Datasheet: https://item.szlcsc.com/datasheet/CSTCE8M00G55-R0/71553.html; Supplier: LCSC; Built - in Load Capacitance: 33pF; Operating Temperature: -20℃~+80℃
C59 C61 = CL31B104KBCNNNC: Capacitance:100nF Tolerance:±10% Tolerance:±10% Voltage Rating:50V Temperature Coefficient:X7R; LCSC Part Name: 100nF ±10% 50V; Supplier Part: C24497; Manufacturer: SAMSUNG(三星); Supplier Footprint: 1206; JLCPCB Part Class: Basic Part; Datasheet: https://item.szlcsc.com/datasheet/CL31B104KBCNNNC/25237.html; Supplier: LCSC; Tolerance: ±10%; Voltage Rating: 50V; Temperature Coefficient: X7R
C64 C66 = CL21A475KAQNNNE: Capacitance:4.7uF Tolerance:±10% Tolerance:±10% Voltage Rating:25V Temperature Coefficient:X5R; LCSC Part Name: 4.7uF ±10% 25V; Supplier Part: C1779; Manufacturer: SAMSUNG(三星); Supplier Footprint: 0805; Datasheet: https://item.szlcsc.com/datasheet/CL21A475KAQNNNE/2131.html; Supplier: LCSC; Tolerance: ±10%; Voltage Rating: 25V; Temperature Coefficient: X5R
C65 C68 = CL21B223KBANNNC: Capacitance:22nF Tolerance:±10% Tolerance:±10% Voltage Rating:50V Temperature Coefficient:X7R; LCSC Part Name: 22nF ±10% 50V; Supplier Part: C1729; Manufacturer: SAMSUNG(三星); Supplier Footprint: 0805; Datasheet: https://item.szlcsc.com/datasheet/CL21B223KBANNNC/2081.html; Supplier: LCSC; Tolerance: ±10%; Voltage Rating: 50V; Temperature Coefficient: X7R
C72 = CL21B105KBFNNNE: Capacitance:1uF Tolerance:±10% Tolerance:±10% Voltage Rating:50V Temperature Coefficient:X7R; LCSC Part Name: 1uF ±10% 50V; Supplier Part: C28323; Manufacturer: SAMSUNG(三星); Supplier Footprint: 0805; Datasheet: https://item.szlcsc.com/datasheet/CL21B105KBFNNNE/29074.html; Supplier: LCSC; Tolerance: ±10%; Voltage Rating: 50V; Temperature Coefficient: X7R
C73-C75 = CL21A226MAQNNNE: Capacitance:22uF Tolerance:±20% Tolerance:±20% Voltage Rating:25V Temperature Coefficient:X5R; LCSC Part Name: 22uF ±20% 25V; Supplier Part: C45783; Manufacturer: SAMSUNG(三星); Supplier Footprint: 0805; Datasheet: https://item.szlcsc.com/datasheet/CL21A226MAQNNNE/46786.html; Supplier: LCSC; Tolerance: ±20%; Voltage Rating: 25V; Temperature Coefficient: X5R
D7 = SS510B: Diode Configuration:- Voltage - Forward(Vf@If):850mV@5A Voltage - DC Reverse(Vr):100V Current - Rectified:5A Reverse Leakage Current (Ir):500uA@100V Operating Junction Temperature Range:-65℃~+150℃ Operating Junction Temperature Range:-65℃~+150℃ Non-Repeti; LCSC Part Name: 电压:100V 电流:5A; Supplier Part: C880749; Manufacturer: Slkor(萨科微); Supplier Footprint: SMB(DO-214AA); JLCPCB Part Class: Extended Part; Datasheet: https://item.szlcsc.com/datasheet/SS510B/943333.html; Supplier: LCSC; Voltage - Forward(Vf@If): 850mV@5A; Voltage - DC Reverse(Vr): 100V; Current - Rectified: 5A; Reverse Leakage Current (Ir): 500uA@100V; Operating Junction Temperature Range: -65℃~+150℃; Non-Repetitive Peak Forward Surge Current: 120A
D8 = SMF12A: Polarity:Unidirectional Reverse Stand-Off Voltage (Vrwm):12V Clamping Voltage:19.9V Peak Pulse Current (Ipp):10.05A Peak Pulse Power Dissipation (Ppp):1kW@8/20us Voltage - Breakdown:13.3V Reverse Leakage Current (Ir):2.5uA Operating Temperature:-55℃~+150℃; LCSC Part Name: 单向TVS 12V截止 峰值浪涌电流：10.05A; Supplier Part: C371082; Manufacturer: DOWO(东沃); Supplier Footprint: SOD-123; Datasheet: https://item.szlcsc.com/datasheet/SMF12A/344718.html; Supplier: LCSC; Polarity: Unidirectional; Reverse Stand-Off Voltage (Vrwm): 12V; Clamping Voltage: 19.9V; Peak Pulse Current (Ipp): 10.05A; Peak Pulse Power Dissipation (Ppp): 1kW@8/20us; Voltage - Breakdown: 13.3V; Reverse Leakage Current (Ir): 2.5uA; Operating Temperature: -55℃~+150℃; Type: TVS
D10 = SMF5.0A: Reverse Stand-Off Voltage (Vrwm):5V Maximum Clamping Voltage:9.2V Peak Pulse Current (Ipp)@10/1000us:21.7A Breakdown Voltage:6.4V Type:TVS; Supplier Part: C132591; Supplier Footprint: SOD-123; Datasheet: https://atta.szlcsc.com/upload/public/pdf/source/20180528/C132591_2E6627FA8E0A601785D44BCCBB8E552F.pdf; Supplier: LCSC; Reverse Stand-Off Voltage (Vrwm): 5V; Maximum Clamping Voltage: 9.2V; Peak Pulse Current (Ipp)@10/1000us: 21.7A; Breakdown Voltage: 6.4V; Type: TVS
D11 = SMF3.3A: Reverse Stand-Off Voltage (Vrwm):3.3V Maximum Clamping Voltage:7.3V Peak Pulse Current (Ipp)@10/1000us:27A Breakdown Voltage:4.1V Reverse Leakage Current (Ir):30uA Type:TVS; LCSC Part Name: 停产; Supplier Part: C717050; Manufacturer: FMS(美丽微); Supplier Footprint: SOD-123; Datasheet: https://atta.szlcsc.com/upload/public/pdf/source/20200814/C717050_265AFBA9FDC1939BED2FD639E25FA6BB.pdf; Supplier: LCSC; Reverse Stand-Off Voltage (Vrwm): 3.3V; Maximum Clamping Voltage: 7.3V; Peak Pulse Current (Ipp)@10/1000us: 27A; Breakdown Voltage: 4.1V; Reverse Leakage Current (Ir): 30uA; Type: TVS
L2 = SM7850-680M(f): Inductance: Tolerance:±20% Tolerance:±20% Rated Current: DC Resistance (DCR):; LCSC Part Name: 68uH ±20%; Supplier Part: C241192; Manufacturer: CEC(振华); Supplier Footprint: SMD,7.8x7mm; JLCPCB Part Class: Extended Part; Datasheet: https://atta.szlcsc.com/upload/public/pdf/source/20180725/C258142_9D126BAC5CCC65D6555900CEF8639777.pdf; Supplier: LCSC; Tolerance: ±20%
R63 = RMC060330K5%N: Type:Thick Film Resistor Resistance:30kΩ Tolerance:±5% Tolerance:±5% Power(Watts):100mW Voltage-Supply(Max):50V Temperature Coefficient:±100ppm/℃ Temperature Coefficient:±100ppm/℃ Operating Temperature:-55℃~+155℃ Operating Temperature:-55℃~+155℃; LCSC Part Name: 30kΩ ±5% 100mW; Supplier Part: C325656; Manufacturer: Tyohm(幸亚电阻); Supplier Footprint: 0603; JLCPCB Part Class: Extended Part; Datasheet: https://item.szlcsc.com/datasheet/RMC060330K5%2525N/305861.html; Supplier: LCSC; Type: Thick Film Resistor; Tolerance: ±5%; Power(Watts): 100mW; Voltage-Supply(Max): 50V; Temperature Coefficient: ±100ppm/℃; Operating Temperature: -55℃~+155℃
R64 = WR08X2743FTL: Type:Thick Film Resistor Resistance:274kΩ Tolerance:±1% Tolerance:±1% Power(Watts):125mW Voltage-Supply(Max):150V Temperature Coefficient:±100ppm/℃ Temperature Coefficient:±100ppm/℃ Operating Temperature:-55℃~+155℃ Operating Temperature:-55℃~+155℃; LCSC Part Name: 厚膜电阻 274kΩ ±1% 125mW; Supplier Part: C334895; Manufacturer: Walsin(华新科); Supplier Footprint: 0805; Datasheet: https://item.szlcsc.com/datasheet/WR08X2743FTL/313333.html; Supplier: LCSC; Type: Thick Film Resistor; Tolerance: ±1%; Power(Watts): 125mW; Voltage-Supply(Max): 150V; Temperature Coefficient: ±100ppm/℃; Operating Temperature: -55℃~+155℃
R65 R66 R69 R70 = KTR03EZPJ103: Type:Thick Film Resistor Resistance:10kΩ Tolerance:±5% Tolerance:±5% Power(Watts):100mW Voltage-Supply(Max):350V Temperature Coefficient:±200ppm/℃ Temperature Coefficient:±200ppm/℃ Operating Temperature:-55℃~+155℃ Operating Temperature:-55℃~+155℃; LCSC Part Name: 厚膜电阻 10kΩ ±5% 100mW; Supplier Part: C2842820; Manufacturer: ROHM(罗姆); Supplier Footprint: 0603; JLCPCB Part Class: Extended Part; Datasheet: https://item.szlcsc.com/datasheet/KTR03EZPJ103/3028895.html; Supplier: LCSC; Type: Thick Film Resistor; Tolerance: ±5%; Power(Watts): 100mW; Voltage-Supply(Max): 350V; Temperature Coefficient: ±200ppm/℃; Operating Temperature: -55℃~+155℃
R71 = WR06X4532FTL: Type:Thick Film Resistor Resistance:45.3kΩ Tolerance:±1% Tolerance:±1% Power(Watts):100mW Voltage-Supply(Max):75V Temperature Coefficient:±100ppm/℃ Temperature Coefficient:±100ppm/℃ Operating Temperature:-55℃~+155℃ Operating Temperature:-55℃~+155℃; LCSC Part Name: 厚膜电阻 45.3kΩ ±1% 100mW; Supplier Part: C334813; Manufacturer: Walsin(华新科); Supplier Footprint: 0603; Datasheet: https://item.szlcsc.com/datasheet/WR06X4532FTL/313251.html; Supplier: LCSC; Type: Thick Film Resistor; Tolerance: ±1%; Power(Watts): 100mW; Voltage-Supply(Max): 75V; Temperature Coefficient: ±100ppm/℃; Operating Temperature: -55℃~+155℃
R72 = RK73B2BTTD512J: Type:Thick Film Resistor Resistance:5.1kΩ Tolerance:±5% Tolerance:±5% Power(Watts):250mW Voltage-Supply(Max):200V Temperature Coefficient:±200ppm/℃ Temperature Coefficient:±200ppm/℃ Operating Temperature:-55℃~+155℃ Operating Temperature:-55℃~+155℃; LCSC Part Name: 厚膜电阻 5.1kΩ ±5% 250mW; Supplier Part: C719309; Manufacturer: KOA; Supplier Footprint: 1206; JLCPCB Part Class: Extended Part; Datasheet: https://item.szlcsc.com/datasheet/RK73B2BTTD512J/761983.html; Supplier: LCSC; Type: Thick Film Resistor; Tolerance: ±5%; Power(Watts): 250mW; Voltage-Supply(Max): 200V; Temperature Coefficient: ±200ppm/℃; Operating Temperature: -55℃~+155℃
R82 = RTT034301FTP: Type:Thick Film Resistor Resistance:4.3kΩ Tolerance:±1% Tolerance:±1% Power(Watts):100mW Voltage-Supply(Max):75V Temperature Coefficient:±100ppm/℃ Temperature Coefficient:±100ppm/℃ Operating Temperature:-55℃~+155℃ Operating Temperature:-55℃~+155℃; LCSC Part Name: 厚膜电阻 4.3kΩ ±1% 100mW; Supplier Part: C103629; Manufacturer: RALEC(旺诠); Supplier Footprint: 0603; JLCPCB Part Class: Extended Part; Datasheet: https://item.szlcsc.com/datasheet/RTT034301FTP/104844.html; Supplier: LCSC; Type: Thick Film Resistor; Tolerance: ±1%; Power(Watts): 100mW; Voltage-Supply(Max): 75V; Temperature Coefficient: ±100ppm/℃; Operating Temperature: -55℃~+155℃
R83 = TD03G7322BT: Type:Thin Film Resistor Resistance:73.2kΩ Tolerance:±0.1% Tolerance:±0.1% Power(Watts):100mW Voltage-Supply(Max):50V Temperature Coefficient:±25ppm/℃ Temperature Coefficient:±25ppm/℃ Operating Temperature:-55℃~+155℃ Operating Temperature:-55℃~+155℃; LCSC Part Name: 薄膜电阻 73.2kΩ ±0.1% 100mW; Supplier Part: C667132; Manufacturer: FH(风华); Supplier Footprint: 0603; JLCPCB Part Class: Extended Part; Datasheet: https://item.szlcsc.com/datasheet/TD03G7322BT/696432.html; Supplier: LCSC; Type: Thin Film Resistor; Tolerance: ±0.1%; Power(Watts): 100mW; Voltage-Supply(Max): 50V; Temperature Coefficient: ±25ppm/℃; Operating Temperature: -55℃~+155℃
U21 = SCT2A23STER: Function:Step-down type Voltage - Supply:4.5V~100V Voltage - Supply:4.5V~100V Output Voltage:1.2V~30V Output Voltage:1.2V~30V Output Current:1.2A Frequency - Switching:300kHz Frequency - Switching:300kHz Operating Temperature:-40℃~+125℃@(TJ) Operating Tem; LCSC Part Name: 降压型 1.2A 4.5V~100V; Supplier Part: C5367629; Manufacturer: SCT(芯洲科技); Supplier Footprint: ESOP-8; JLCPCB Part Class: Extended Part; Datasheet: https://item.szlcsc.com/datasheet/SCT2A23STER/6207041.html; Supplier: LCSC; Function: Step-down type; Voltage - Supply: 4.5V~100V; Output Voltage: 1.2V~30V; Output Current: 1.2A; Frequency - Switching: 300kHz; Operating Temperature: -40℃~+125℃@(TJ); Synchronous Rectifier: Yes; Number of Outputs: 1; Topology: Buck; Quiescent Current: 15uA; Switch tube (built-in/external): Built-in; Output Type: Adjustable; Features: Light load efficient mode；Cycle-by-cycle current limiting；Overcurrent Protection
U22 = HGC0805G0680J500NTGJ: Capacitance:68pF Tolerance:±5% Tolerance:±5% Voltage Rating:50V Temperature Coefficient:C0G; LCSC Part Name: 68pF ±5% 50V; Supplier Part: C5186760; Manufacturer: Chinocera(华瓷); Supplier Footprint: 0805; JLCPCB Part Class: Extended Part; Datasheet: https://item.szlcsc.com/datasheet/HGC0805G0680J500NTGJ/5857769.html; Supplier: LCSC; Tolerance: ±5%; Voltage Rating: 50V; Temperature Coefficient: C0G
U23 U25 = RY8120: Function:Step-down type Synchronous Rectification:Yes; LCSC Part Name: 18V 2A 500KHz 同步降压调节器; Supplier Part: C370756; Manufacturer: RYCHiP(蕊源); Supplier Footprint: SOT-23-6; Datasheet: https://atta.szlcsc.com/upload/public/pdf/source/20190329/C370756_26420FCEB0B1DE61B32FCD5A3A341A78.pdf; Supplier: LCSC; Function: Step-down type; Synchronous Rectification: Yes
U24 U26 = 2.2uH: Supplier Part: C9900023765; Supplier Footprint: IND-SMD; Supplier: LCSC

## Nets
3.3V: C38.2 C41.2 C44.2 C46.2 C47.2 C48.2 C49.2 C50.2 C72.2 C75.2 D11.1(C) R48.1 R51.1 R54.1 R61.1 R71.2 U13.5(REF) U14.5(REF) U15.5(REF) U18.1(VBAT) U18.13(VDDA) U18.19(VDD) U18.32(VDD) U18.48(VDD) U18.64(VDD) U19.4 U26.2
12V: C34.2 C35.2 C36.2 C64.2 C73.2 D4.1(A) D5.1(A) D6.1(A) D8.1(K) L2.2 R20.1(VCC) R39.1(VCC) R40.1(VCC) R64.2 R65.1 U22.2 U23.5(IN)
+5V: C66.2 C74.2 C76.2 D10.1(K) R69.1 R83.2 U24.2 U25.5(IN) U29.3(VDD)
AGND: C18.1 C19.1 C20.1 C34.1 C35.1 C36.1 C37.1 C38.1 C39.2 C40.1 C41.1 C42.2 C43.1 C44.1 C45.2 C46.1 C47.1 C48.1 C49.1 C50.1 C51.1 C52.1 C58.2 C59.1 C60.1 C62.2 C64.1 C66.1 C72.1 C73.1 C74.1 C75.1 C76.1 D7.2(A) D8.2(A) D10.2(A) D11.2(A) H2.1 R20.4(GND) R39.4(GND) R40.4(GND) R47.1 R49.1 R50.1 R52.1 R53.1 R55.1 R56.1 R57.1 R58.1 R63.1 R66.1 R70.1 SW1.1 U12.3 U13.2(GND) U13.3(IN+) U14.2(GND) U14.3(IN+) U15.2(GND) U15.3(IN+) U18.12(VSSA) U18.18(VSS) U18.60(BOOT0) U18.63(VSS) U19.1 U21.1(GND) U21.9(GND) U22.1 U23.2(GND) U25.2(GND) U29.2(VSS) U29.8(RS) X3.2(VSS)
CLK: U18.49(PA14(JTCK-SWCLK)) U19.2
CUR1: C25.2 C37.2 Q2.2(S) Q2.3(S) Q2.5(S) Q2.6(S) Q2.7(S) R47.2 U13.4(IN-)
CUR2: C26.2 C40.2 Q4.2(S) Q4.3(S) Q4.5(S) Q4.6(S) Q4.7(S) R50.2 U14.4(IN-)
CUR3: C27.2 C43.2 Q6.2(S) Q6.3(S) Q6.5(S) Q6.6(S) Q6.7(S) R53.2 U15.4(IN-)
CURRENT_U: C39.1 H2.4 U13.1(OUT) U18.8(PC0)
CURRENT_V: C42.1 H2.3 U14.1(OUT) U18.9(PC1)
CURRENT_W: C45.1 H2.2 U15.1(OUT) U18.10(PC2)
DIO: U18.46(PA13(JTMS-SWDIO)) U19.3
DP+: U18.45(PA12)
DP-: U18.44(PA11)
PHASE_U: C30.2 C31.1 Q1.2(S) Q1.3(S) Q1.5(S) Q1.6(S) Q1.7(S) Q2.4(D) R20.6(VS) R59.2 U20.3
PHASE_V: C29.2 C32.1 Q3.2(S) Q3.3(S) Q3.5(S) Q3.6(S) Q3.7(S) Q4.4(D) R32.2 R39.6(VS) U20.2
PHASE_W: C28.2 C33.1 Q5.2(S) Q5.3(S) Q5.5(S) Q5.6(S) Q5.7(S) Q6.4(D) R40.6(VS) R60.2 U20.1
RESET: C58.1 R61.2 SW1.2 U18.7(NRST)
RXD: U18.61(PB8) U29.4(RXD)
TXD: U18.62(PB9) U29.1(TXD)
U_HIN: H2.8 R20.2(HIN) R73.1
U_HO: R20.7(HO) R41.1
U_LIN: H2.5 R20.3(LIN) R76.1
U_LO: R20.5(LO) R42.1
U_VD: R57.2 R59.1 R79.1
UH: R73.2 U18.41(PA8)
UL: R76.2 U18.34(PB13)
UV: R79.2 U18.14(PA0-WKUP(PA0))
V_HIN: H2.9 R39.2(HIN) R74.1
V_HO: R39.7(HO) R44.1
V_LIN: H2.6 R39.3(LIN) R77.1
V_LO: R39.5(LO) R43.1
V_VD: R32.1 R56.2 R80.1
VH: R74.2 U18.42(PA9)
VL: R77.2 U18.35(PB14)
VSUPPLY: C18.2 C19.2 C20.2 C59.2 C60.2 Q1.4(D) Q3.4(D) Q5.4(D) U12.1 U21.2(VIN)
VV: R80.2 U18.15(PA1)
W_HIN: H2.10 R40.2(HIN) R75.1
W_HO: R40.7(HO) R45.1
W_LIN: H2.7 R40.3(LIN) R78.1
W_LO: R40.5(LO) R46.1
W_VD: R58.2 R60.1 R81.1
WH: R75.2 U18.43(PA10)
WL: R78.2 U18.36(PB15)
WV: R81.2 U18.16(PA2)
$1N18971: C31.2 D4.2(K) R20.8(VB)
$1N19331: C30.1 Q1.1(G) R41.2
$1N19521: C25.1 Q2.1(G) R42.2
$1N20357: C29.1 Q3.1(G) R44.2
$1N20372: C26.1 Q4.1(G) R43.2
$1N20703: C28.1 Q5.1(G) R45.2
$1N20718: C27.1 Q6.1(G) R46.2
$1N21329: C32.2 D5.2(K) R39.8(VB)
$1N21568: C33.2 D6.2(K) R40.8(VB)
$2N2212: C51.2 U18.47(VCAP_2)
$2N2213: C52.2 U18.31(VCAP_1)
$2N3961: U18.5(PH0-OSC_IN(PH0)) X3.1
$2N3971: U18.6(PH1-OSC_OUT(PH1)) X3.3
$2N5800: R84.2 U27.2 U29.7(CANH)
$2N5978: R84.1 U27.3 U29.6(CANL)
$3N1194: C61.1 U21.7(BST)
$3N1200: C61.2 D7.1(K) L2.1 U21.8(SW)
$3N1280: R72.1 U21.5(FB)
$3N1335: C62.1 U21.6(VCC)
$3N1802: R63.2 R64.1 R72.2
$3N2447: R65.2 U23.4(EN)
$3N2564: C65.2 U23.6(SW) U24.1
$3N2639: C65.1 U23.1(BS)
$3N2843: R82.2 R83.1
$3N2847: R66.2 R82.1 U23.3(FB)
$3N3585: R69.2 U25.4(EN)
$3N3587: C68.2 U25.6(SW) U26.1
$3N3594: C68.1 U25.1(BS)
$3N3603: R70.2 R71.1 U25.3(FB)
$4N1093: R48.2 R49.2 U13.6(VS)
$4N1104: R51.2 R52.2 U14.6(VS)
$4N1115: R54.2 R55.2 U15.6(VS)

Not connected (* = marked no-connect by the designer): R85 1 2; R86 1 2; R87 1 2; U12 2; U18 2(PC13)* 3(PC14-OSC32_IN(PC14))* 4(PC15-OSC32_OUT(PC15))* 11(PC3) 17(PA3) 20(PA4)* 21(PA5) 22(PA6) 23(PA7)* 24(PC4) 25(PC5) 26(PB0)* 27(PB1)* 28(PB2-BOOT1(PB2))* 29(PB10) 30(PB11) 33(PB12)* 37(PC6) 38(PC7) 39(PC8) 40(PC9)* 50(PA15(JTDI)) 51(PC10) 52(PC11) 53(PC12)* 54(PD2)* 55(PB3(JTDOTRACESWO))* 56(PB4(NJTRST))* 57(PB5) 58(PB6) 59(PB7); U21 3(EN)* 4(MODE)*; U27 1 4; U28 1 2 3 4; U29 5(VREF)*

## Notes on the sheets
sheet 1
- Gate Drive
sheet 2
- REset
sheet 4
- CURRENT SENSE
